# Altium schematic sheet power_supply.SchDoc
size Letter; SheetNumber: 3; SheetTotal: 8
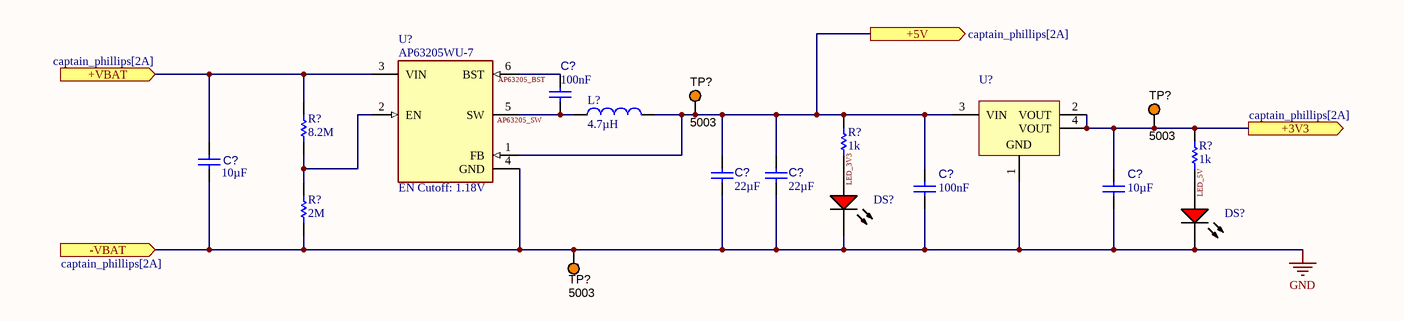
[diagram p0: power_supply.SchDoc]

## Parts
(Parts that share a designator on the sheet are numbered #1, #2 ... from top to bottom, then left to right.)
C?#1  value 100nF  [CAPC1005X05M]  (hidden comment: Capacitor 100nF 10 % 50V 0402)
C?#2  value 10µF  [3]  (hidden comment: Capacitor 10 uF 20 % 25V 0603)
C?#3  value 22µF  [3]  (hidden comment: Capacitor 22 uF 20 % 10V 0603)
C?#4  value 22µF  [3]  (hidden comment: Capacitor 22 uF 20 % 10V 0603)
C?#5  value 100nF  [3]  (hidden comment: Capacitor 100 nF 10 % 50V 0603)
C?#6  value 10µF  [3]  (hidden comment: Capacitor 10 uF 20 % 25V 0603)
DS?#1  19-217/R6C-AL1M2VY/3T  [EVRL-0603-2_V]  (value not drawn)
DS?#2  19-217/R6C-AL1M2VY/3T  [EVRL-0603-2_V]  (value not drawn)
L?  value 4.7µH  [FP-SPM6530-0]  (hidden comment: SPM6530T-4R7M-HZ)
R?#1  value 1k  [RESC1608X55X25ML10T15]  (hidden comment: 1K 1% 0603)
R?#2  value 8.2M  [RESC1608X55X25ML10T15]  (hidden comment: 8M2 1 0603)
R?#3  value 1k  [RESC1608X55X25ML10T15]  (hidden comment: 1K 1% 0603)
R?#4  value 2M  [RESC1608X55X25ML10T15]  (hidden comment: 2M 1 0603)
TP?#1  5003  [KSTN-5003]
TP?#2  5003  [KSTN-5003]
TP?#3  5003  [KSTN-5003]
U?#1  AP63205WU-7  [FP-TSOT26-MFG]
U?#2  LDL1117S33R  [STM-SOT-223_M]  (value not drawn)

## Ports
+3V3 (out, see captain_phillips[2A]), +5V (out, see captain_phillips[2A]), +VBAT (in, see captain_phillips[2A]), -VBAT (in, see captain_phillips[2A])

## Nets
GND: C?#2.1 C?#3.1 C?#4.1 C?#5.1 C?#6.1 DS?#1.2(K) DS?#2.2(K) R?#4.1 TP?#3.1 U?#1.4(GND) U?#2.1(GND) ; port -VBAT
+3V3: C?#6.2 R?#3.1 TP?#2.1 U?#2.2(VOUT) U?#2.4(VOUT) ; port +3V3
+5V: C?#3.2 C?#4.2 C?#5.2 L?.2 R?#1.1 TP?#1.1 U?#1.1(FB) U?#2.3(VIN) ; port +5V
+VBAT: C?#2.2 R?#2.2 U?#1.3(VIN) ; port +VBAT
AP63205_BST: C?#1.2 U?#1.6(BST)
AP63205_SW: C?#1.1 L?.1 U?#1.5(SW)
LED_3V3: DS?#1.1(A) R?#1.2
LED_5V: DS?#2.1(A) R?#3.2
NetR?#2_1: R?#2.1 R?#4.2 U?#1.2(EN)

## Notes on the sheet
- (near U?#1) EN Cutoff: 1.18V

## Library data of the parts
C?#1 = CMP-001-00135-7: CAP CER 100nF 25V X7R 0402; Tolerance: 10%; Capacitor Type: Ceramic; Voltage Rating: 25V; Mounting Technology: Surface Mount; Case/Package: 0402; Max Operating Temperature: 125°C; RoHS Compliant: Yes; Min Operating Temperature: -55°C; Pins: 2; LCSC Part Number: C307331
C?#2 C?#6 = CMP-001-00101-3: CAP CER 10UF 25V X5R 0603; Capacitor Type: Ceramic; Tolerance: 20%; Case/Package: 0603; Voltage Rating: 25V; LCSC Part Number: C96446
C?#3 C?#4 = CMP-001-00128-4: CAP CER 22UF 10V X5R 0603; Tolerance: 20%; Capacitor Type: Ceramic; Mounting Technology: Surface Mount; Voltage Rating: 10V; Max Operating Temperature: 85°C; Min Operating Temperature: -55°C; Pins: 2; RoHS Compliant: Yes; Case/Package: 0603; LCSC Part Number: C59461
C?#5 = CMP-001-00092-5: CAP CER 100 nF 50V X7R 0603; Tolerance: 10%; Capacitor Type: Ceramic; Voltage Rating: 50V; Case/Package: 0603; LCSC Part Number: C14663
DS?#1 DS?#2 = CMP-007-00004-3: Chip LED, Red, 5 V, 25 mA, -40 to 85 degC, 2-Pin SMD (0603), RoHS, Tape and Reel; Manufacturer: Everlight Electronics; Forward Voltage: 2.2V; Lens Style: Clear; Package Reference: 0603; Datasheet Version: Rev. 1, 01/2005; Mounting Technology: SM; RoHS Compliant: False; Datasheet URL: https://datasheet.ciiva.com/4688/el-19-217-r6c-al1m2vy-3tpdf-187026-4688713.pdf; Case/Package: 0603; Colour: Red; Manufacturer URL: http://www.everlight.com/; Package Description: 2-Pin Surface Mount Device, Body 1.6 x 0.8 mm; LCSC Part Number: C2286
L? = CMP-006-00027-2: General Purpose Inductor, 4.7uH, 20%, 1 Element, Metal-Core, SMD, 2826; Max Current Rating: 5.6A; RoHS Compliant: Yes; Case/Package: SPM6530T-4R7M-HZ; Inductor Type: GENERAL PURPOSE INDUCTOR; LCSC Part Number: C360729
R?#1 R?#3 = CMP-0103-0583-9: 0603 (1608 Metric) 1/10 W 1K 1% Thick Film Chip Resistor; Case-Metric: 1608; Power: 100mW; Case-EIA: 0603; Temp. Coefficent: ±100; Technology: SMT; Tolerance: 1%; Case/Package: 0603; LCSC Part Number: C21190
R?#2 = CMP-0103-0677-7: 0603 (1608 Metric) 1/10 W 8M2 1 Thick Film Chip Resistor; Power: 100mW; Temp. Coefficent: ±100; Tolerance: 1%; Case-Metric: 1608; Case-EIA: 0603; Technology: SMT
R?#4 = CMP-0103-0662-7: 0603 (1608 Metric) 1/10 W 2M 1 Thick Film Chip Resistor; Case-Metric: 1608; Case-EIA: 0603; Power: 100mW; Tolerance: 1%; Temp. Coefficent: ±100; Technology: SMT
TP?#1-TP?#3 = CMP-002-00037-3: Test Point, Orange, Height 4.6 mm, Tail Length 3 mm, 1-Pin THD, RoHS; Manufacturer: Keystone; Case/Package: 5003; RoHS Compliant: True; Mounting Technology: TH; Connector Type: TestPoint; Pins: 1; Colour: Orange; Packaging: Bulk; Package Description: 1-Pin Through Hole Device, Dia 2.54 mm; Package Reference: 5003; Datasheet Version: Jun-15; Diameter: 2.54mm; Contact Material: Bronze; Datasheet URL: http://keyelco.com/userAssets/file/M65p56.pdf; Manufacturer URL: http://www.keyelco.com/; Package Quantity: 10; Contact Plating: Tin; LCSC Part Number: C238122
U?#1 = CMP-019-00057-2: Switching Regulator; LCSC Part Number: C2071056
U?#2 = CMP-019-00076-2: Fixed Positive LDO Regulator, 3.3V, 0.6V Dropout, PDSO4; Manufacturer: STMicroelectronics; Output Current: 950mA; Output Voltage1-Max: 3.399V; Output Current1-Max: 1.2A; Number of Outputs: 1; Max Input Voltage: 15V; Time @ Peak Reflow Temperature-Max (s): 30s; Min Input Voltage: 4.3V; Max Supply Voltage: 18V; Dropout Voltage1-Nom: 1.1V; Power: 12W; Output Voltage1-Min: 3.201V; Max Ouput Current: 1.3A; Regulator Type: FIXED POSITIVE SINGLE OUTPUT LDO REGULATOR; Qualification Status: Not Qualified; Dropout Voltage1-Max: 600mV; Min Supply Voltage: 4.75V; Voltage Tolerance-Max: 2%; Package Body Material: Plastic; Technology: BIPOLAR; Mounting Technology: SM; Reach SVHC Compliant: Yes; Package Quantity: 2500; Channels: 1; Max Operating Temperature: 125°C; Output Voltage: 3.3V; Terminal Finish: Tin; Terminal Pitch: 2.3mm; Operating Temperature, TJ-Min: -40°C; Surface Mount: Yes; Moisture Sensitivity Level: 1; Peak Reflow Temperature (Cel): 260°C; Datasheet URL: http://www.farnell.com/datasheets/1776449.pdf; RoHS Compliant: Yes; Terminal Form: Gull Wing; Width: 3.5mm; Height - Seated (Max): 1.9mm; Operating Temperature, TJ-Max: 125°C; Length: 6.5mm; Package Description: 4-Pin Small Outline Transistor, Body 6.5 x 3.5 mm, Pitch 2.3 mm; Output Voltage1-Nom: 3.3V; Package Style: SMALL OUTLINEMeter; Dropout Voltage: 1.1V; Outputs: 1; JESD-609 Code: e3; Manufacturer URL: http://www.st.com/; Datasheet Version: Rev. 33, 11/2013; Package Shape: Rectangular; Package Reference: SOT-223; JESD-30 Code: R-PDSO-G4; Packaging: Tape and Reel; Input Voltage Absolute-Max: 15V; Pins: 4; Adjustability: FIXED; Nominal Output Voltage: 3.3V; Min Operating Temperature: 0°C; Case/Package: SOP; Terminal Position: DUAL; LCSC Part Number: C435835